# EAGLE design MAAV_RoombaShieldOnly_2V0 (EAGLE 6.4)
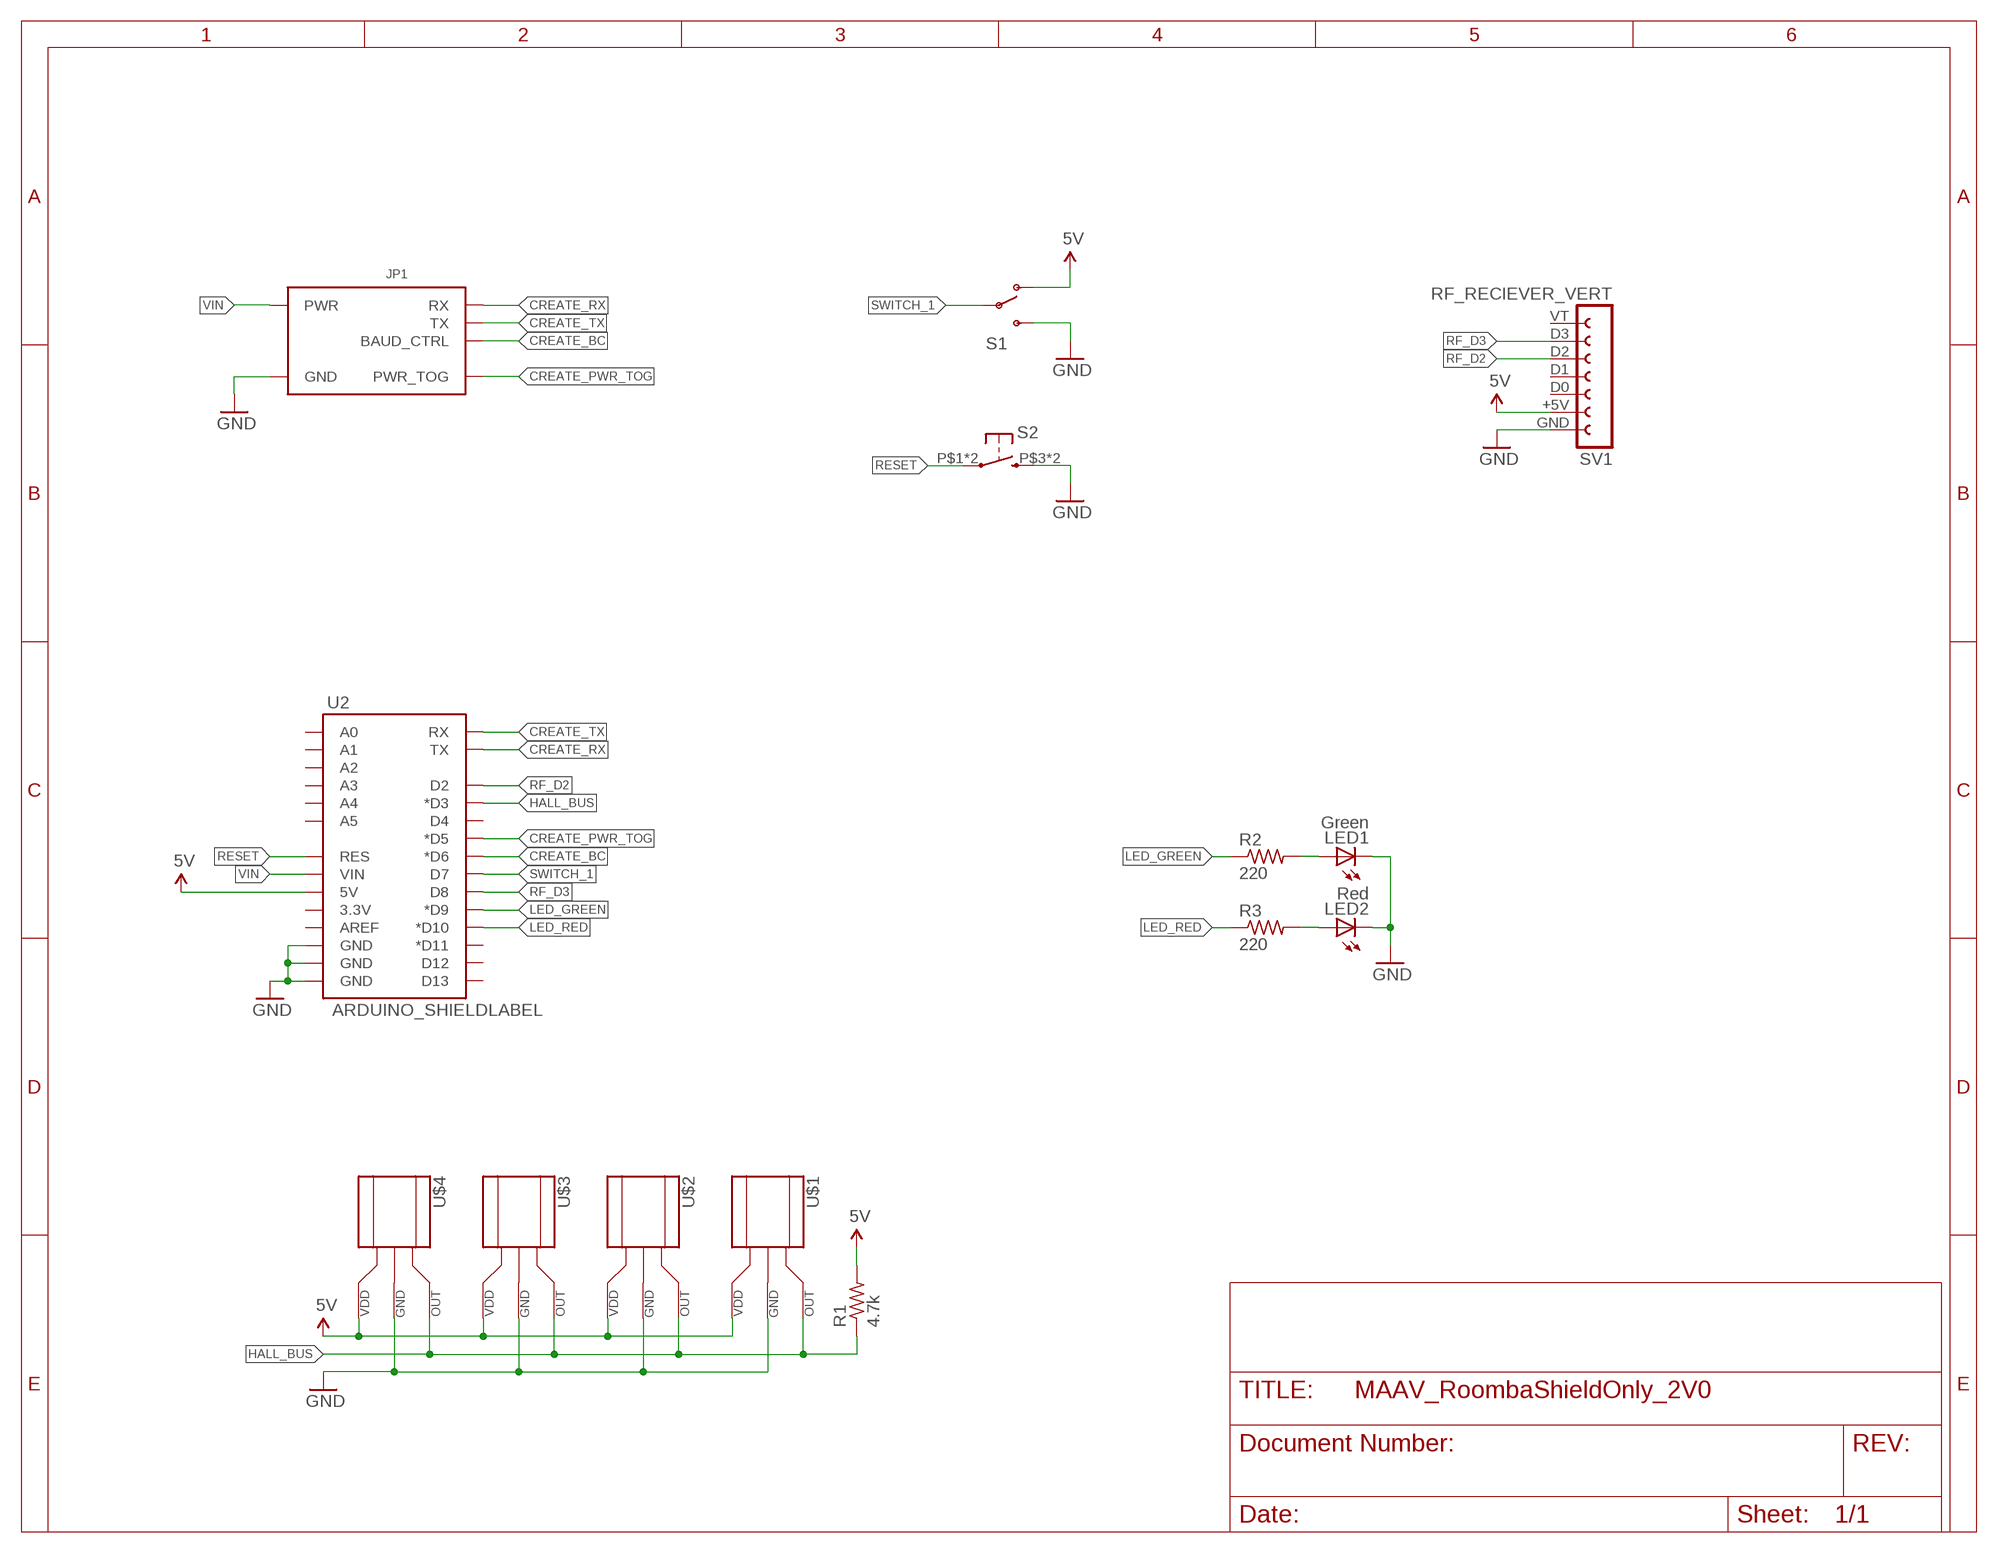
[diagram p0: schematic, sheet 1]

## Parts
JP1  IROBOT_CREATE_IARC_HOOKUP  [2X5-SHROUDED]
LED1  Green  LEDCHIPLED_0603  [CHIPLED_0603]
LED2  Red  LEDCHIPLED_0603  [CHIPLED_0603]
R1  4.7k  R-USR0603  [R0603]
R2  220  R-USR0603  [R0603]
R3  220  R-USR0603  [R0603]
S1  SWITCH-SPDTTHRU-VERT  [SWITCH-SPDT_THRU-VERT]
S2  TACT_BUTTON_SMD  [SIMPLE_BUTTON_SMD]
SV1  RF_RECIEVER_VERT  [RF_RECIEVER_VERT]
U2  ARDUINO_SHIELDLABEL  [DUEMILANOVE_SHIELD]
U$1  HALL_EFFECTHEADER  [1X03]
U$2  HALL_EFFECTHEADER  [1X03]
U$3  HALL_EFFECTHEADER  [1X03]
U$4  HALL_EFFECTHEADER  [1X03]

## Nets
5V: R1.2 S1.1(O) SV1.+5V U2.5V U$1.1(VDD) U$2.1(VDD) U$3.1(VDD) U$4.1(VDD)
CREATE_BC: JP1.3(BAUD_CTRL) U2.D6(*D6)
CREATE_PWR_TOG: JP1.5(PWR_TOG) U2.D5(*D5)
CREATE_RX: JP1.4(RX) U2.TX
CREATE_TX: JP1.1(TX) U2.RX
GND: JP1.2(GND) LED1.C LED2.C S1.3(S) S2.P$3(S) S2.P$4(S) SV1.GND U2.GND@0(GND) U2.GND@1(GND) U2.GND@2(GND) U$1.2(GND) U$2.2(GND) U$3.2(GND) U$4.2(GND)
HALL_BUS: R1.1 U2.D3(*D3) U$1.3(OUT) U$2.3(OUT) U$3.3(OUT) U$4.3(OUT)
LED_GREEN: R2.1 U2.D9(*D9)
LED_RED: R3.1 U2.D10(*D10)
N$1: LED1.A R2.2
N$2: LED2.A R3.2
RESET: S2.P$1(P) S2.P$2(P) U2.RES
RF_D2: SV1.D2 U2.D2
RF_D3: SV1.D3 U2.D8
SWITCH_1: S1.2(P) U2.D7
VIN: JP1.6(PWR) U2.VIN
Unconnected: SV1.D0 SV1.D1 SV1.VT U2.3.3V U2.A0 U2.A1 U2.A2 U2.A3 U2.A4 U2.A5 U2.AREF U2.D4 U2.D11(*D11) U2.D12 U2.D13

## Library data of the parts
JP1 = MAAV_Roomba:IROBOT_CREATE_IARC_HOOKUP: 0.1" spaced headers
LED1 LED2 = Jon_LIB:LED: LED OSRAM: - CHIPLED LG R971, LG N971, LY N971, LG Q971, LY Q971, LO R971, LY R971 LH N974, LH R974 LS Q976, LO Q976, LY Q976 LO Q996 - Hyper CHIPLED LW Q18S LB Q993, LB Q99A, LB R99A - SideLED LS A670, LO A670, LY A670, LG A670, LP A670 LB A673, LV A673, LT A673, LW A673 LH A674 LY A675 LS A676, LA A676, LO A676, LY A676, LW A676 LS A679, LY A679, LG A679 - Hyper Micro SIDELED® LS Y876, LA Y876, LO Y876, LY Y876 LT Y87S - SmartLED LW L88C, LW L88S LB L89C, LB L89S, LG L890 LS L89K, LO L89K, LY L89K LS L896, LA L896, LO L896, LY L896 - TOPLED LS T670, LO T670, LY T670, LG T670, LP T670 LSG T670, LSP T670, LSY T670, LOP T670, LYG T670 LG T671, LOG T671, LSG T671 LB T673, LV T673, LT T673, LW T673 LH T674 LS T676, LA T676, LO T676, LY T676, LB T676, LH T676, LSB T676, LW T676 LB T67C, LV T67C, LT T67C, LS T67K, LO T67K, LY T67K, LW E67C LS E67B, LA E67B, LO E67B, LY E67B, LB E67C, LV E67C, LT E67C LW T67C LS T679, LY T679, LG T679 LS T770, LO T770, LY T770, LG T770, LP T770 LB T773, LV T773, LT T773, LW T773 LH T774 LS E675, LA E675, LY E675, LS T675 LS T776, LA T776, LO T776, LY T776, LB T776 LHGB T686 LT T68C, LB T68C - Hyper Mini TOPLED® LB M676 - Mini TOPLED Santana® LG M470 LS M47K, LO M47K, LY M47K Source: http://www.osram.convergy.de LUXEON: - LUMILED® LXK2-PW12-R00, LXK2-PW12-S00, LXK2-PW14-U00, LXK2-PW14-V00 LXK2-PM12-R00, LXK2-PM12-S00, LXK2-PM14-U00 LXK2-PE12-Q00, LXK2-PE12-R00, LXK2-PE12-S00, LXK2-PE14-T00, LXK2-PE14-U00 LXK2-PB12-K00, LXK2-PB12-L00, LXK2-PB12-M00, LXK2-PB14-N00, LXK2-PB14-P00, LXK2-PB14-Q00 LXK2-PR12-L00, LXK2-PR12-M00, LXK2-PR14-Q00, LXK2-PR14-R00 LXK2-PD12-Q00, LXK2-PD12-R00, LXK2-PD12-S00 LXK2-PH12-R00, LXK2-PH12-S00 LXK2-PL12-P00, LXK2-PL12-Q00, LXK2-PL12-R00 Source: www.luxeon.com KINGBRIGHT: KA-3528ASYC Source: www.kingbright.com
R1-R3 = Jon_LIB:R-US: RESISTOR, American symbol
S1 = MAAV_Roomba:SWITCH-SPDT: SPDT Switch Simple slide switch; DIGIKEY#: EG1903-ND; MANUFACTURER-PN: EG1218; SPARKFUN#: COM-00102
S2 = MAAV_Roomba:TACT_BUTTON: OMRON SWITCH; DIGIKEY#: CKN10361CT-ND
SV1 = MAAV_Roomba:RF_RECIEVER: FEMALE HEADER; DIGIKEY#: S7005-ND; MF: Sulins; MPN: PPTC071LFBN-RC
U2 = MAAV_Roomba:ARDUINO_SHIELD: Arduino shield footprint
U$1-U$4 = MAAV_Roomba:HALL_EFFECT

## Board
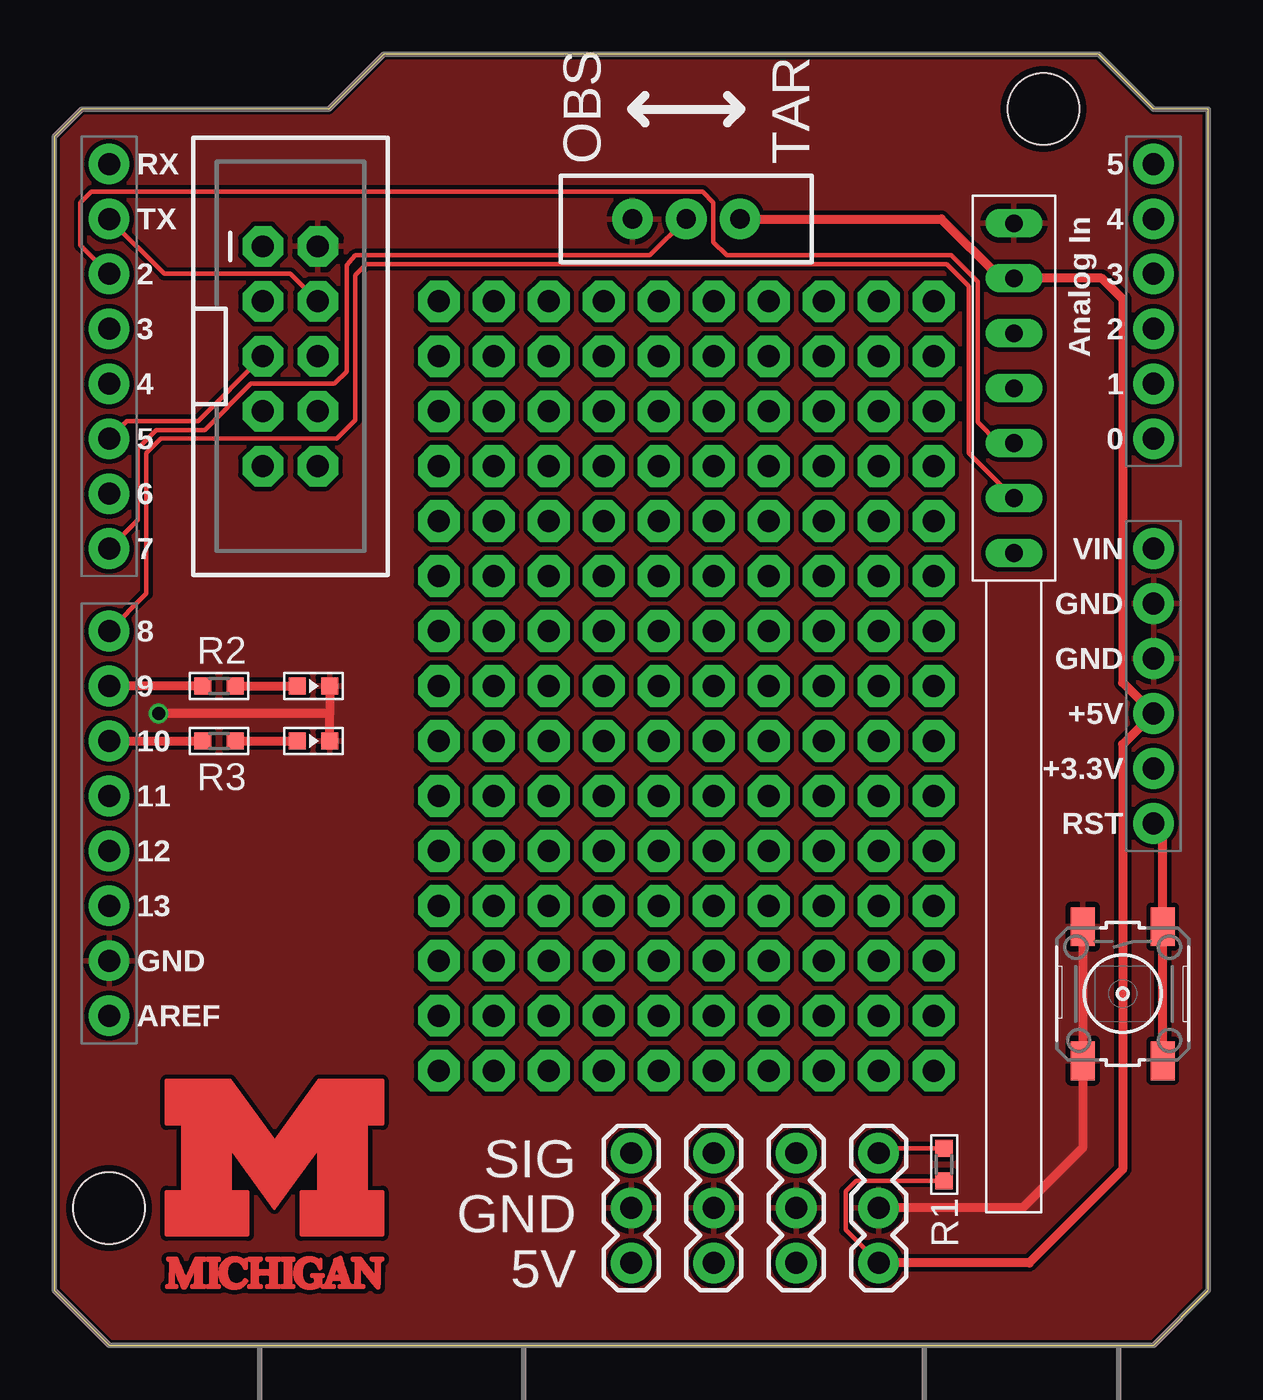
[diagram p1: board, top side]
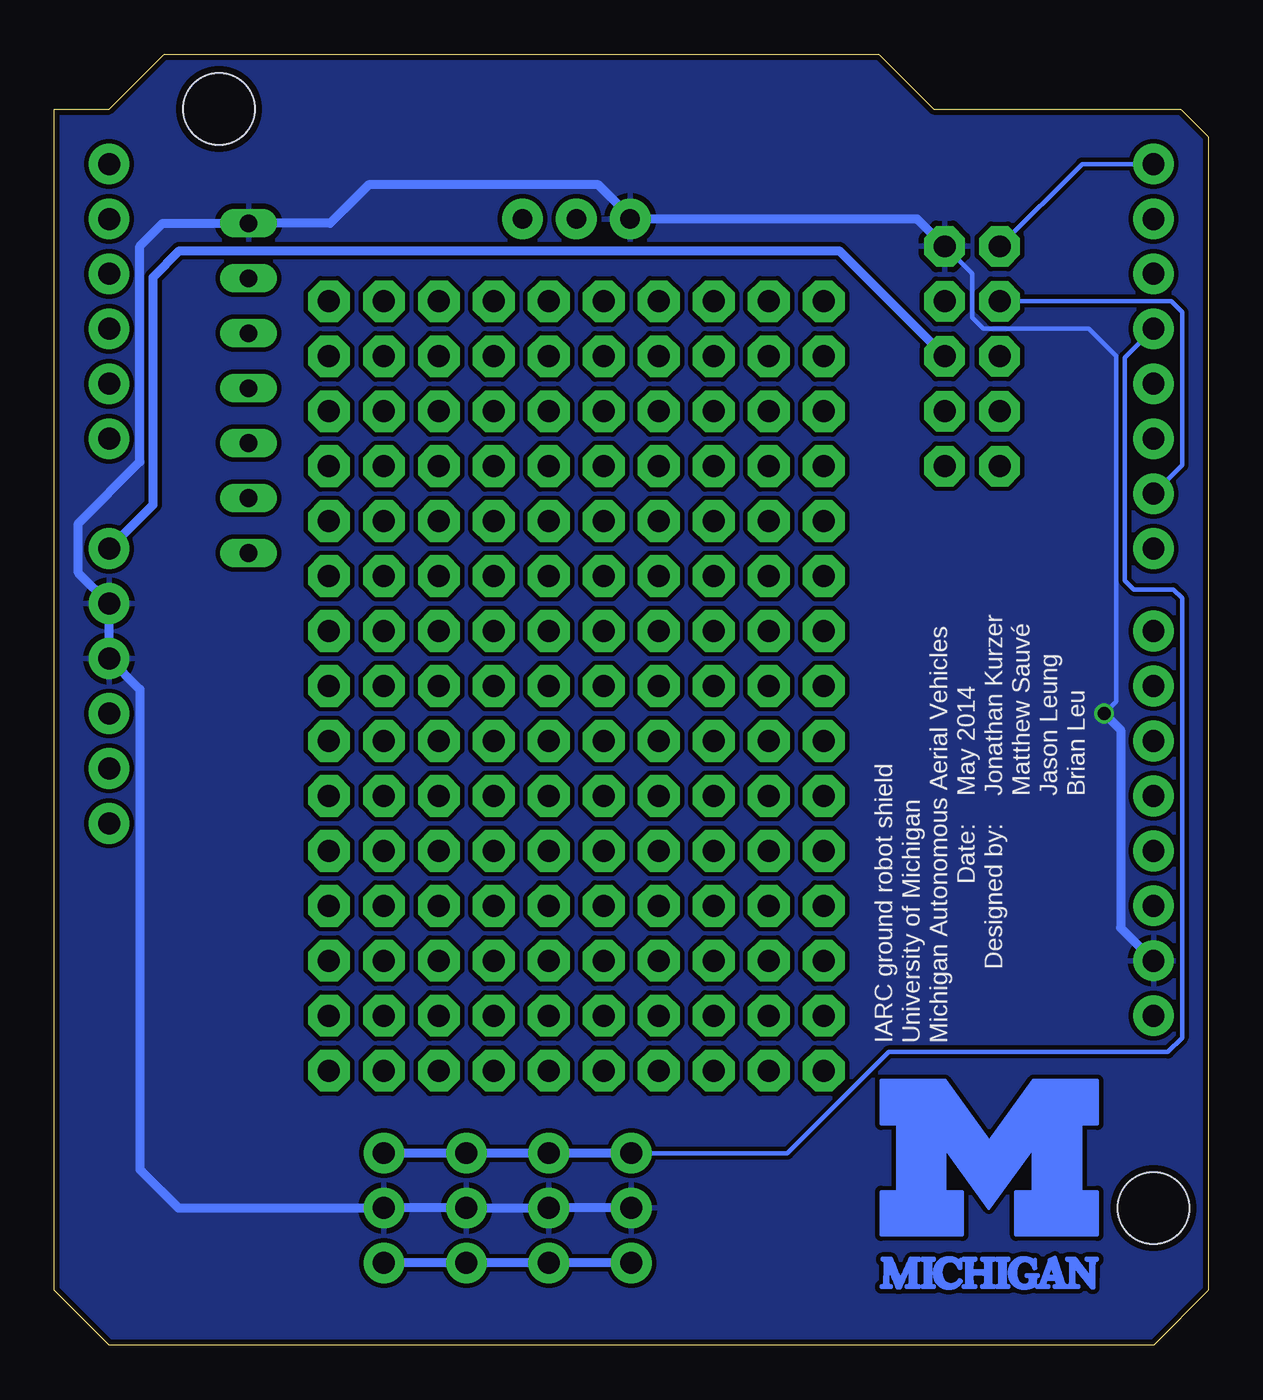
[diagram p2: board, bottom side, seen from below]

Size 53.34 x 59.69 mm. Coordinates in mm from the lower left corner, seen from the top.
Outline: 0,2.54 2.54,0 50.8,0 53.34,2.54 53.34,57.15 50.8,57.15 48.26,59.69 15.24,59.69 12.7,57.15 1.27,57.15 0,55.88 0,2.54
Copper layers (1*16): Top 0.035mm / dielectric 1.5mm / Bottom 0.035mm
Design rules "ITEADstudio_2-layer_DRC *": minimum track width 6mil, minimum drill 12mil, track to track 8mil, track to pad 8mil, pad to pad 8mil, via to via 8mil, smd to smd 0mil, copper to edge 10mil, drill to drill 10mil, minimum pad ring 10mil, minimum via ring 6mil, stop-mask expansion 2mil, vias tented up to drill 100mil, thermal gap 10mil

### Footprints (pad centres in the part's own frame; a part is rotated, then mirrored left to right if it is on the bottom)
2X5-SHROUDED = drill 1.016 pad 1.88 octagon: 1 -1.27,5.08; 2 1.27,5.08; 3 -1.27,2.54; 4 1.27,2.54; 5 -1.27,0; 6 1.27,0; 7 -1.27,-2.54; 8 1.27,-2.54; 9 -1.27,-5.08; 10 1.27,-5.08
CHIPLED_0603 = smd 0.8 x 0.8: A -0.75,0; C 0.75,0
R0603 = smd 0.8 x 0.8: 1 -0.75,0; 2 0.75,0
SWITCH-SPDT_THRU-VERT = drill 0.9 pad 1.88: 1 0,2.489; 2 0,0; 3 0,-2.489
SIMPLE_BUTTON_SMD = smd 1.8 x 1.1: P$1 -3.1,1.85; P$2 3.1,1.85; P$3 -3.1,-1.85; P$4 3.1,-1.85
RF_RECIEVER_VERT = drill 0.813 long: +5V 5.08,0; D0 2.54,0; D1 0,0; D2 -2.54,0; D3 -5.08,0; GND 7.62,0; VT -7.62,0
DUEMILANOVE_SHIELD = drill 1.016 pad 1.88: 3.3V 50.8,26.67; 5V 50.8,29.21; A0 50.8,41.91; A1 50.8,44.45; A2 50.8,46.99; A3 50.8,49.53; A4 50.8,52.07; A5 50.8,54.61; AREF 2.54,15.24; D2 2.54,49.53; D3 2.54,46.99; D4 2.54,44.45; D5 2.54,41.91; D6 2.54,39.37; D7 2.54,36.83; D8 2.54,33.02; D9 2.54,30.48; D10 2.54,27.94; D11 2.54,25.4; D12 2.54,22.86; D13 2.54,20.32; GND@0 50.8,31.75; GND@1 50.8,34.29; GND@2 2.54,17.78; RES 50.8,24.13; RX 2.54,54.61; TX 2.54,52.07; VIN 50.8,36.83 | hole 3.302: 45.72,57.15; 2.54,6.35
1X03 = drill 1.016 pad 1.88: 1 0,0; 2 2.54,0; 3 5.08,0

### Placement (x,y rotation side)
JP1  10.92,45.72 0 top
LED1  11.99,30.48 0 top
LED2  11.99,27.94 0 top
R1  41.12,8.36 270 top
R2  7.62,30.48 0 top
R3  7.62,27.94 0 top
S1  29.21,52.07 270 top
S2  49.38,16.26 270 top
SV1  44.35,44.25 90 top
U2  0,0 0 top
U$1  26.67,3.81 90 top
U$2  30.48,3.81 90 top
U$3  34.29,3.81 90 top
U$4  38.1,3.81 90 top
U$12  [BLOCK-M-STACKED_10MM_MASK]  10.16,6.35 0 top
U$13  [BLOCK-M-STACKED_10MM_MASK]  10.16,6.35 0 bottom

### Tracks (layer width: path | path; a pad name or v marks a point on that pad's centre or on a via)
5V
  Top 0.203: R1.2 37.07,7.61 36.58,7.11 36.58,5.33 U$4.1
  Top 0.406: S1.1 41,52.07 43.74,49.33 SV1.+5V 48.41,49.33 49.38,48.36 49.38,30.63 U2.5V 49.38,27.79 49.38,8.13 45.06,3.81 U$4.1
  Bottom 0.406: U$1.1 U$2.1 U$3.1 U$4.1
CREATE_BC
  Bottom 0.203: U2.D6 1.22,40.69 1.22,47.75 1.73,48.26 JP1.3
CREATE_PWR_TOG
  Top 0.203: JP1.5 6.66,42.72 3.35,42.72 U2.D5
CREATE_RX
  Top 0.203: U2.TX 5.08,49.53 10.92,49.53 JP1.4
CREATE_TX
  Bottom 0.203: U2.RX 5.84,54.61 JP1.1
GND  (via drill 0.6)
  Top 0.406: LED1.C 12.74,29.21 | 12.74,29.21 v4.83,29.21 | LED2.C 12.74,29.21 | S2.P$3 S2.P$4 47.53,9.12 44.76,6.35 U$4.2
  Bottom 0.203: JP1.2 10.92,49.53 10.92,47.5 10.41,46.99 5.54,46.99 4.27,45.72 4.27,29.77 v4.83,29.21
  Bottom 0.406: U$1.2 U$2.2 U$3.2 U$4.2 47.6,6.35 49.38,8.13 49.38,30.33 U2.GND@0 U2.GND@1 52.22,35.71 52.22,38 49.38,40.84 49.38,50.8 48.31,51.87 SV1.GND 40.59,51.87 38.81,53.65 28.19,53.65 26.67,52.12 S1.3 | S1.3 26.67,52.02 | v4.83,29.21 4.06,28.45 4.06,19.3 U2.GND@2 | JP1.2 13.46,52.07 S1.3
  pour Bottom: -0.2,-0.2 53.85,-0.2 53.85,60.15 -0.2,60.15
  pour Top: -0.2,-0.2 53.85,-0.2 53.85,60.15 -0.2,60.15
HALL_BUS
  Top 0.203: R1.1 38.32,9.11 U$4.3
  Bottom 0.203: U2.D3 3.86,45.67 3.86,35.36 3.45,34.95 1.63,34.95 1.22,34.54 1.22,14.22 1.88,13.56 14.78,13.56 19.46,8.89 U$1.3
  Bottom 0.406: U$1.3 U$2.3 U$3.3 U$4.3
LED_GREEN
  Top 0.406: R2.1 U2.D9
LED_RED
  Top 0.406: U2.D10 R3.1
N$1
  Top 0.406: R2.2 LED1.A
N$2
  Top 0.406: R3.2 LED2.A
N$3  (via drill 1.02 pad 1.93)
  other vias: 17.78,48.26
N$4  (via drill 1.02 pad 1.93)
  other vias: 17.78,45.72
N$5  (via drill 1.02 pad 1.93)
  other vias: 20.32,48.26
N$7  (via drill 1.02 pad 1.93)
  other vias: 22.86,48.26
N$9  (via drill 1.02 pad 1.93)
  other vias: 25.4,48.26
N$11  (via drill 1.02 pad 1.93)
  other vias: 27.94,48.26
N$13  (via drill 1.02 pad 1.93)
  other vias: 30.48,48.26
N$15  (via drill 1.02 pad 1.93)
  other vias: 33.02,48.26
N$17  (via drill 1.02 pad 1.93)
  other vias: 35.56,48.26
N$19  (via drill 1.02 pad 1.93)
  other vias: 38.1,48.26
N$21  (via drill 1.02 pad 1.93)
  other vias: 40.64,48.26
N$23  (via drill 1.02 pad 1.93)
  other vias: 20.32,45.72
N$24  (via drill 1.02 pad 1.93)
  other vias: 22.86,45.72
N$25  (via drill 1.02 pad 1.93)
  other vias: 25.4,45.72
N$26  (via drill 1.02 pad 1.93)
  other vias: 27.94,45.72
N$27  (via drill 1.02 pad 1.93)
  other vias: 30.48,45.72
N$28  (via drill 1.02 pad 1.93)
  other vias: 33.02,45.72
N$29  (via drill 1.02 pad 1.93)
  other vias: 35.56,45.72
N$30  (via drill 1.02 pad 1.93)
  other vias: 38.1,45.72
N$31  (via drill 1.02 pad 1.93)
  other vias: 40.64,45.72
N$32  (via drill 1.02 pad 1.93)
  other vias: 17.78,43.18
N$33  (via drill 1.02 pad 1.93)
  other vias: 20.32,43.18
N$34  (via drill 1.02 pad 1.93)
  other vias: 22.86,43.18
N$35  (via drill 1.02 pad 1.93)
  other vias: 25.4,43.18
N$36  (via drill 1.02 pad 1.93)
  other vias: 27.94,43.18
N$37  (via drill 1.02 pad 1.93)
  other vias: 30.48,43.18
N$38  (via drill 1.02 pad 1.93)
  other vias: 33.02,43.18
N$39  (via drill 1.02 pad 1.93)
  other vias: 35.56,43.18
N$40  (via drill 1.02 pad 1.93)
  other vias: 38.1,43.18
N$41  (via drill 1.02 pad 1.93)
  other vias: 40.64,43.18
N$42  (via drill 1.02 pad 1.93)
  other vias: 17.78,40.64
N$43  (via drill 1.02 pad 1.93)
  other vias: 20.32,40.64
N$44  (via drill 1.02 pad 1.93)
  other vias: 22.86,40.64
N$45  (via drill 1.02 pad 1.93)
  other vias: 25.4,40.64
N$46  (via drill 1.02 pad 1.93)
  other vias: 27.94,40.64
N$47  (via drill 1.02 pad 1.93)
  other vias: 30.48,40.64
N$48  (via drill 1.02 pad 1.93)
  other vias: 33.02,40.64
N$49  (via drill 1.02 pad 1.93)
  other vias: 35.56,40.64
N$50  (via drill 1.02 pad 1.93)
  other vias: 38.1,40.64
N$51  (via drill 1.02 pad 1.93)
  other vias: 40.64,40.64
N$52  (via drill 1.02 pad 1.93)
  other vias: 17.78,38.1
N$53  (via drill 1.02 pad 1.93)
  other vias: 20.32,38.1
N$54  (via drill 1.02 pad 1.93)
  other vias: 22.86,38.1
N$55  (via drill 1.02 pad 1.93)
  other vias: 25.4,38.1
N$56  (via drill 1.02 pad 1.93)
  other vias: 27.94,38.1
N$57  (via drill 1.02 pad 1.93)
  other vias: 30.48,38.1
N$58  (via drill 1.02 pad 1.93)
  other vias: 33.02,38.1
N$59  (via drill 1.02 pad 1.93)
  other vias: 35.56,38.1
N$60  (via drill 1.02 pad 1.93)
  other vias: 38.1,38.1
N$61  (via drill 1.02 pad 1.93)
  other vias: 40.64,38.1
N$62  (via drill 1.02 pad 1.93)
  other vias: 17.78,35.56
N$63  (via drill 1.02 pad 1.93)
  other vias: 20.32,35.56
N$64  (via drill 1.02 pad 1.93)
  other vias: 22.86,35.56
N$65  (via drill 1.02 pad 1.93)
  other vias: 25.4,35.56
N$66  (via drill 1.02 pad 1.93)
  other vias: 27.94,35.56
N$67  (via drill 1.02 pad 1.93)
  other vias: 30.48,35.56
N$68  (via drill 1.02 pad 1.93)
  other vias: 33.02,35.56
N$69  (via drill 1.02 pad 1.93)
  other vias: 35.56,35.56
N$70  (via drill 1.02 pad 1.93)
  other vias: 38.1,35.56
N$71  (via drill 1.02 pad 1.93)
  other vias: 40.64,35.56
N$72  (via drill 1.02 pad 1.93)
  other vias: 17.78,33.02
N$73  (via drill 1.02 pad 1.93)
  other vias: 20.32,33.02
N$74  (via drill 1.02 pad 1.93)
  other vias: 22.86,33.02
N$75  (via drill 1.02 pad 1.93)
  other vias: 25.4,33.02
N$76  (via drill 1.02 pad 1.93)
  other vias: 27.94,33.02
N$77  (via drill 1.02 pad 1.93)
  other vias: 30.48,33.02
N$78  (via drill 1.02 pad 1.93)
  other vias: 33.02,33.02
N$79  (via drill 1.02 pad 1.93)
  other vias: 35.56,33.02
N$80  (via drill 1.02 pad 1.93)
  other vias: 38.1,33.02
N$81  (via drill 1.02 pad 1.93)
  other vias: 40.64,33.02
N$82  (via drill 1.02 pad 1.93)
  other vias: 17.78,30.48
N$83  (via drill 1.02 pad 1.93)
  other vias: 20.32,30.48
N$84  (via drill 1.02 pad 1.93)
  other vias: 22.86,30.48
N$85  (via drill 1.02 pad 1.93)
  other vias: 25.4,30.48
N$86  (via drill 1.02 pad 1.93)
  other vias: 27.94,30.48
N$87  (via drill 1.02 pad 1.93)
  other vias: 30.48,30.48
N$88  (via drill 1.02 pad 1.93)
  other vias: 33.02,30.48
N$89  (via drill 1.02 pad 1.93)
  other vias: 35.56,30.48
N$90  (via drill 1.02 pad 1.93)
  other vias: 38.1,30.48
N$91  (via drill 1.02 pad 1.93)
  other vias: 40.64,30.48
N$92  (via drill 1.02 pad 1.93)
  other vias: 17.78,27.94
N$93  (via drill 1.02 pad 1.93)
  other vias: 20.32,27.94
N$94  (via drill 1.02 pad 1.93)
  other vias: 22.86,27.94
N$95  (via drill 1.02 pad 1.93)
  other vias: 25.4,27.94
N$96  (via drill 1.02 pad 1.93)
  other vias: 27.94,27.94
N$97  (via drill 1.02 pad 1.93)
  other vias: 30.48,27.94
N$98  (via drill 1.02 pad 1.93)
  other vias: 33.02,27.94
N$99  (via drill 1.02 pad 1.93)
  other vias: 35.56,27.94
N$100  (via drill 1.02 pad 1.93)
  other vias: 38.1,27.94
N$101  (via drill 1.02 pad 1.93)
  other vias: 40.64,27.94
N$102  (via drill 1.02 pad 1.93)
  other vias: 17.78,25.4
N$103  (via drill 1.02 pad 1.93)
  other vias: 20.32,25.4
N$104  (via drill 1.02 pad 1.93)
  other vias: 22.86,25.4
N$105  (via drill 1.02 pad 1.93)
  other vias: 25.4,25.4
N$106  (via drill 1.02 pad 1.93)
  other vias: 27.94,25.4
N$107  (via drill 1.02 pad 1.93)
  other vias: 30.48,25.4
N$108  (via drill 1.02 pad 1.93)
  other vias: 33.02,25.4
N$109  (via drill 1.02 pad 1.93)
  other vias: 35.56,25.4
N$110  (via drill 1.02 pad 1.93)
  other vias: 38.1,25.4
N$111  (via drill 1.02 pad 1.93)
  other vias: 40.64,25.4
N$112  (via drill 1.02 pad 1.93)
  other vias: 17.78,22.86
N$113  (via drill 1.02 pad 1.93)
  other vias: 20.32,22.86
N$114  (via drill 1.02 pad 1.93)
  other vias: 22.86,22.86
N$115  (via drill 1.02 pad 1.93)
  other vias: 25.4,22.86
N$116  (via drill 1.02 pad 1.93)
  other vias: 27.94,22.86
N$117  (via drill 1.02 pad 1.93)
  other vias: 30.48,22.86
N$118  (via drill 1.02 pad 1.93)
  other vias: 33.02,22.86
N$119  (via drill 1.02 pad 1.93)
  other vias: 35.56,22.86
N$120  (via drill 1.02 pad 1.93)
  other vias: 38.1,22.86
N$121  (via drill 1.02 pad 1.93)
  other vias: 40.64,22.86
N$122  (via drill 1.02 pad 1.93)
  other vias: 17.78,20.32
N$123  (via drill 1.02 pad 1.93)
  other vias: 20.32,20.32
N$124  (via drill 1.02 pad 1.93)
  other vias: 22.86,20.32
N$125  (via drill 1.02 pad 1.93)
  other vias: 25.4,20.32
N$126  (via drill 1.02 pad 1.93)
  other vias: 27.94,20.32
N$127  (via drill 1.02 pad 1.93)
  other vias: 30.48,20.32
N$128  (via drill 1.02 pad 1.93)
  other vias: 33.02,20.32
N$129  (via drill 1.02 pad 1.93)
  other vias: 35.56,20.32
N$130  (via drill 1.02 pad 1.93)
  other vias: 38.1,20.32
N$131  (via drill 1.02 pad 1.93)
  other vias: 40.64,20.32
N$132  (via drill 1.02 pad 1.93)
  other vias: 17.78,17.78
N$133  (via drill 1.02 pad 1.93)
  other vias: 20.32,17.78
N$134  (via drill 1.02 pad 1.93)
  other vias: 22.86,17.78
N$135  (via drill 1.02 pad 1.93)
  other vias: 25.4,17.78
N$136  (via drill 1.02 pad 1.93)
  other vias: 27.94,17.78
N$137  (via drill 1.02 pad 1.93)
  other vias: 30.48,17.78
N$138  (via drill 1.02 pad 1.93)
  other vias: 33.02,17.78
N$139  (via drill 1.02 pad 1.93)
  other vias: 35.56,17.78
N$140  (via drill 1.02 pad 1.93)
  other vias: 38.1,17.78
N$141  (via drill 1.02 pad 1.93)
  other vias: 40.64,17.78
N$142  (via drill 1.02 pad 1.93)
  other vias: 17.78,15.24
N$143  (via drill 1.02 pad 1.93)
  other vias: 20.32,15.24
N$144  (via drill 1.02 pad 1.93)
  other vias: 22.86,15.24
N$145  (via drill 1.02 pad 1.93)
  other vias: 25.4,15.24
N$146  (via drill 1.02 pad 1.93)
  other vias: 27.94,15.24
N$147  (via drill 1.02 pad 1.93)
  other vias: 30.48,15.24
N$148  (via drill 1.02 pad 1.93)
  other vias: 33.02,15.24
N$149  (via drill 1.02 pad 1.93)
  other vias: 35.56,15.24
N$150  (via drill 1.02 pad 1.93)
  other vias: 38.1,15.24
N$151  (via drill 1.02 pad 1.93)
  other vias: 40.64,15.24
N$152  (via drill 1.02 pad 1.93)
  other vias: 17.78,12.7
N$153  (via drill 1.02 pad 1.93)
  other vias: 20.32,12.7
N$154  (via drill 1.02 pad 1.93)
  other vias: 22.86,12.7
N$155  (via drill 1.02 pad 1.93)
  other vias: 25.4,12.7
N$156  (via drill 1.02 pad 1.93)
  other vias: 27.94,12.7
N$157  (via drill 1.02 pad 1.93)
  other vias: 30.48,12.7
N$158  (via drill 1.02 pad 1.93)
  other vias: 33.02,12.7
N$159  (via drill 1.02 pad 1.93)
  other vias: 35.56,12.7
N$160  (via drill 1.02 pad 1.93)
  other vias: 38.1,12.7
N$161  (via drill 1.02 pad 1.93)
  other vias: 40.64,12.7
RESET
  Top 0.406: S2.P$2 S2.P$1 51.23,23.7 U2.RES
RF_D2
  Top 0.203: SV1.D2 43.64,41.71 42.67,42.67 42.67,49.17 41.45,50.39 31.09,50.39 30.45,51 30.45,52.83 29.97,53.34 1.73,53.34 1.22,52.83 1.22,50.85 U2.D2
RF_D3
  Top 0.203: SV1.D3 42.27,41.25 42.27,48.97 41.25,49.99 14.43,49.99 13.92,49.48 13.92,42.77 13.06,41.91 4.93,41.91 4.27,41.25 4.27,34.75 U2.D8
SWITCH_1
  Top 0.203: U2.D7 3.86,38.15 3.86,41.45 4.72,42.32 6.96,42.32 9.09,44.45 12.95,44.45 13.51,45.01 13.51,49.94 13.92,50.39 27.53,50.39 S1.2
VIN
  Bottom 0.406: U2.VIN 48.77,38.86 48.77,49.38 47.55,50.6 17.07,50.6 JP1.6

### Text on the board
tPlace: OBS | TAR | SIG | GND | 5V
bPlace: Brian Leu | Jason Leung | Matthew Sauvé | Jonathan Kurzer | May 2014 | Designed by: | Date: | Michigan Autonomous Aerial Vehicles | University of Michigan | IARC ground robot shield